# Altium schematic sheet hmi.SchDoc: Projet M1 2024
size A4; DrawnBy: J.CLEMENT & D.FOURNIER; Revision: V1.0 Rev A; SheetNumber: 6; SheetTotal: 7
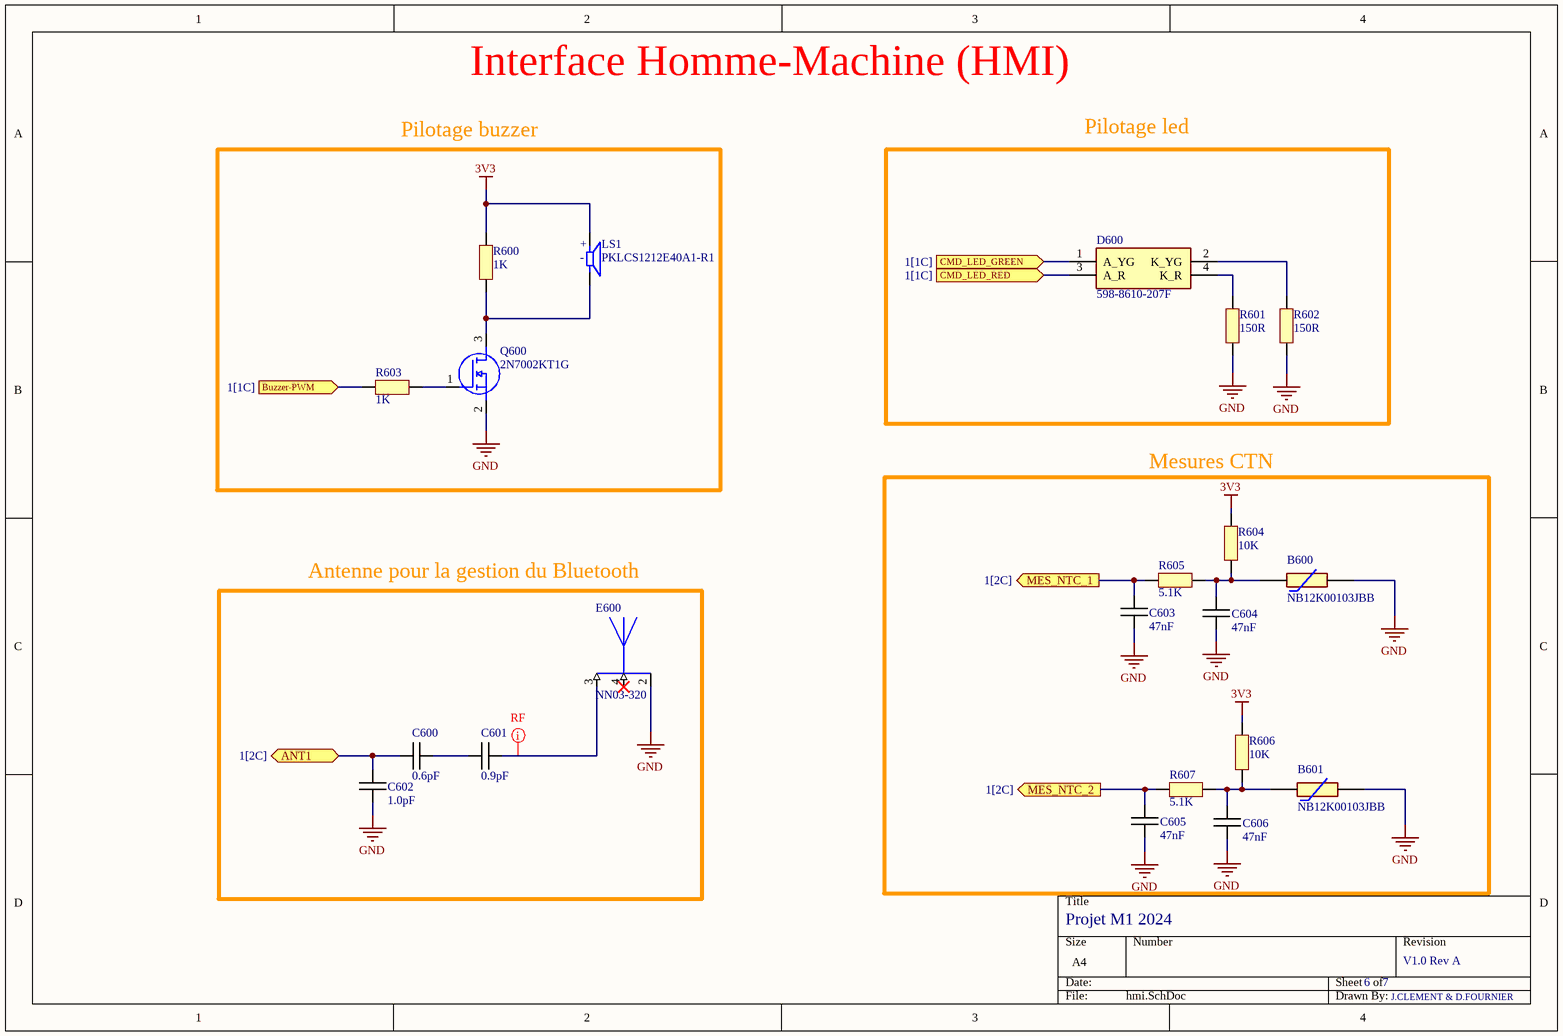
[diagram p0: hmi.SchDoc]

## Parts
B600  NB12K00103JBB  [RESC2212X50N]
B601  NB12K00103JBB  [RESC2212X50N]
C600  0.6pF  [CAPA_0603]
C601  0.9pF  [CAPA_0603]
C602  1.0pF  [CAPA_0603]
C603  47nF  [CAPA_0603]
C604  47nF  [CAPA_0603]
C605  47nF  [CAPA_0603]
C606  47nF  [CAPA_0603]
D600  598-8610-207F  [5988610207F]
E600  NN03-320  [XCVR_NN03-320]
LS1  PKLCS1212E40A1-R1  [SPKR_PKLCS1212E40A1-R1]
Q600  2N7002KT1G  [SOT96P237X111-3N]
R600  1K  [RES_0603]
R601  150R  [RES_0603]
R602  150R  [RES_0603]
R603  1K  [RES_0603]
R604  10K  [RES_0603]
R605  5.1K  [RES_0603]
R606  10K  [RES_0603]
R607  5.1K  [RES_0603]

## Blocks framed on the sheet
Pilotage buzzer: LS1 Q600 R600 R603
Pilotage led: D600 R601 R602
Mesures CTN: B600 B601 C603-C606 R604-R607
Antenne pour la gestion du Bluetooth: C600-C602 E600

## Ports
ANT1 (bidir, see 1[2C]), Buzzer-PWM (in, see 1[1C]), CMD_LED_GREEN (in, see 1[1C]), CMD_LED_RED (in, see 1[1C]), MES_NTC_1 (out, see 1[2C]), MES_NTC_2 (out, see 1[2C])

## Nets
3V3: LS1.P R600.2 R604.2 R606.2
GND: B600.2 B601.2 C602.2 C603.2 C604.2 C605.2 C606.2 E600.2(GROUND) Q600.2(S) R601.1 R602.1
ANT1: C600.1 C602.1 ; port ANT1
Buzzer-PWM: R603.1 ; port Buzzer-PWM
CMD_LED_GREEN: D600.1(A_YG) ; port CMD_LED_GREEN
CMD_LED_RED: D600.3(A_R) ; port CMD_LED_RED
MES_NTC_1: C603.1 R605.1 ; port MES_NTC_1
MES_NTC_2: C605.1 R607.1 ; port MES_NTC_2
NetB600_1: B600.1 C604.1 R604.1 R605.2
NetB601_1: B601.1 C606.1 R606.1 R607.2
NetC600_2: C600.2 C601.2
NetC601_1: C601.1 E600.3(FEED_BLUETOOTH)
NetD600_2: D600.2(K_YG) R602.2
NetD600_4: D600.4(K_R) R601.2
NetLS1_N: LS1.N Q600.3(D) R600.1
NetQ600_1: Q600.1(G) R603.2

Not connected (* = marked no-connect by the designer): E600 4(FEED_GNSS)*

## Layout directives
rule Width Constraint [Pref Impedance = 50,00ohms    Min Impedance = 50,00ohms    Max Impedance = 50,00ohms]: NetC601_1

## Notes on the sheet
- Interface Homme-Machine (HMI)
- (in symbol PKLCS1212E40A1-R1) +; -

## Library data of the parts
B600 B601 = NB12K00103JBB: NTC SMD Thermistor, NB12K, 10K, 5% AVX 10k 0805 Protection NTC Thermistor, 5s, 2 x 1.25 x 1.3mm; Manufacturer_Name: Kyocera AVX; Geometry.Height: 0.5mm; Manufacturer_Part_Number: NB12K00103JBB; Mouser Part Number: 581-NB12K00103JBB; Mouser Price/Stock: https://www.mouser.co.uk/ProductDetail/AVX/NB12K00103JBB/?qs=4%252B6%252BTdINQeDPvI%252BQUQjJ3Q%3D%3D; Arrow Part Number: NB12K00103JBB; Arrow Price/Stock: https://www.arrow.com/en/products/nb12k00103jbb/avx; Datasheet Link: https://datasheet.datasheetarchive.com/originals/distributors/Datasheets-DGA6/551314.pdf
C600-C606 = Capacitor
D600 = 598-8610-207F: Standard LEDs - SMD Red/Green WC 80/50mcd 645/570nm; Manufacturer_Name: Dialight; Geometry.Height: 0.8mm; Manufacturer_Part_Number: 598-8610-207F; Mouser Part Number: 645-598-8610-207F; Mouser Price/Stock: https://www.mouser.co.uk/ProductDetail/Dialight/598-8610-207F?qs=7JStj%2FjQ2SFuCjosqwklHQ%3D%3D; Arrow Part Number: 598-8610-207F; Arrow Price/Stock: https://www.arrow.com/en/products/598-8610-207f/dialight?region=nac; Datasheet Link: https://media.digikey.com/pdf/Data%20Sheets/Dialight%20PDFs/598%20Series%201210%20Pkg%20Bi-Color.pdf
E600 = NN03-320: Dual port antenna booster for GNSS, Bluetooth, 5G and UWB (1561 - 1606MHz, 2400 - 2500MHz, 3400 - 3800MHz, 3100 - 4800MHz and 6000 - 10600 MHz), signal booster; Manufacturer_Name: Ignion; Manufacturer_Part_Number: NN03-320; Mouser Part Number: 128-NN03-320
LS1 = PKLCS1212E40A1-R1: Buzzers Transducer, Externally Driven Piezo 1.5V 2kHz 70dB @ 1.5V, 10cm Surface Mount Solder Pads; MF: Murata Electronics; Value: *; MP: PKLCS1212E40A1-R1; Package: None; Availability: Unavailable; Price: None
Q600 = 2N7002KT1G: MOSFET N-Ch 60V 380mA Small Signal SOT23 ON Semiconductor 2N7002KT1G N-channel MOSFET Transistor, 380 mA, 60 V, 3-Pin SOT-23; Manufacturer_Name: onsemi; Geometry.Height: 1.11mm; Manufacturer_Part_Number: 2N7002KT1G; Mouser Part Number: 863-2N7002KT1G; Mouser Price/Stock: https://www.mouser.co.uk/ProductDetail/onsemi/2N7002KT1G?qs=Jh7l0IbPjifUiTytu%252BGGDQ%3D%3D; Arrow Part Number: 2N7002KT1G; Arrow Price/Stock: https://www.arrow.com/en/products/2n7002kt1g/on-semiconductor?utm_currency=USD&region=nac; Datasheet Link: http://www.onsemi.com/pub/Collateral/2N7002K-D.PDF
R600-R607 = Resistor